# Altium schematic sheet power.SchDoc
size A3
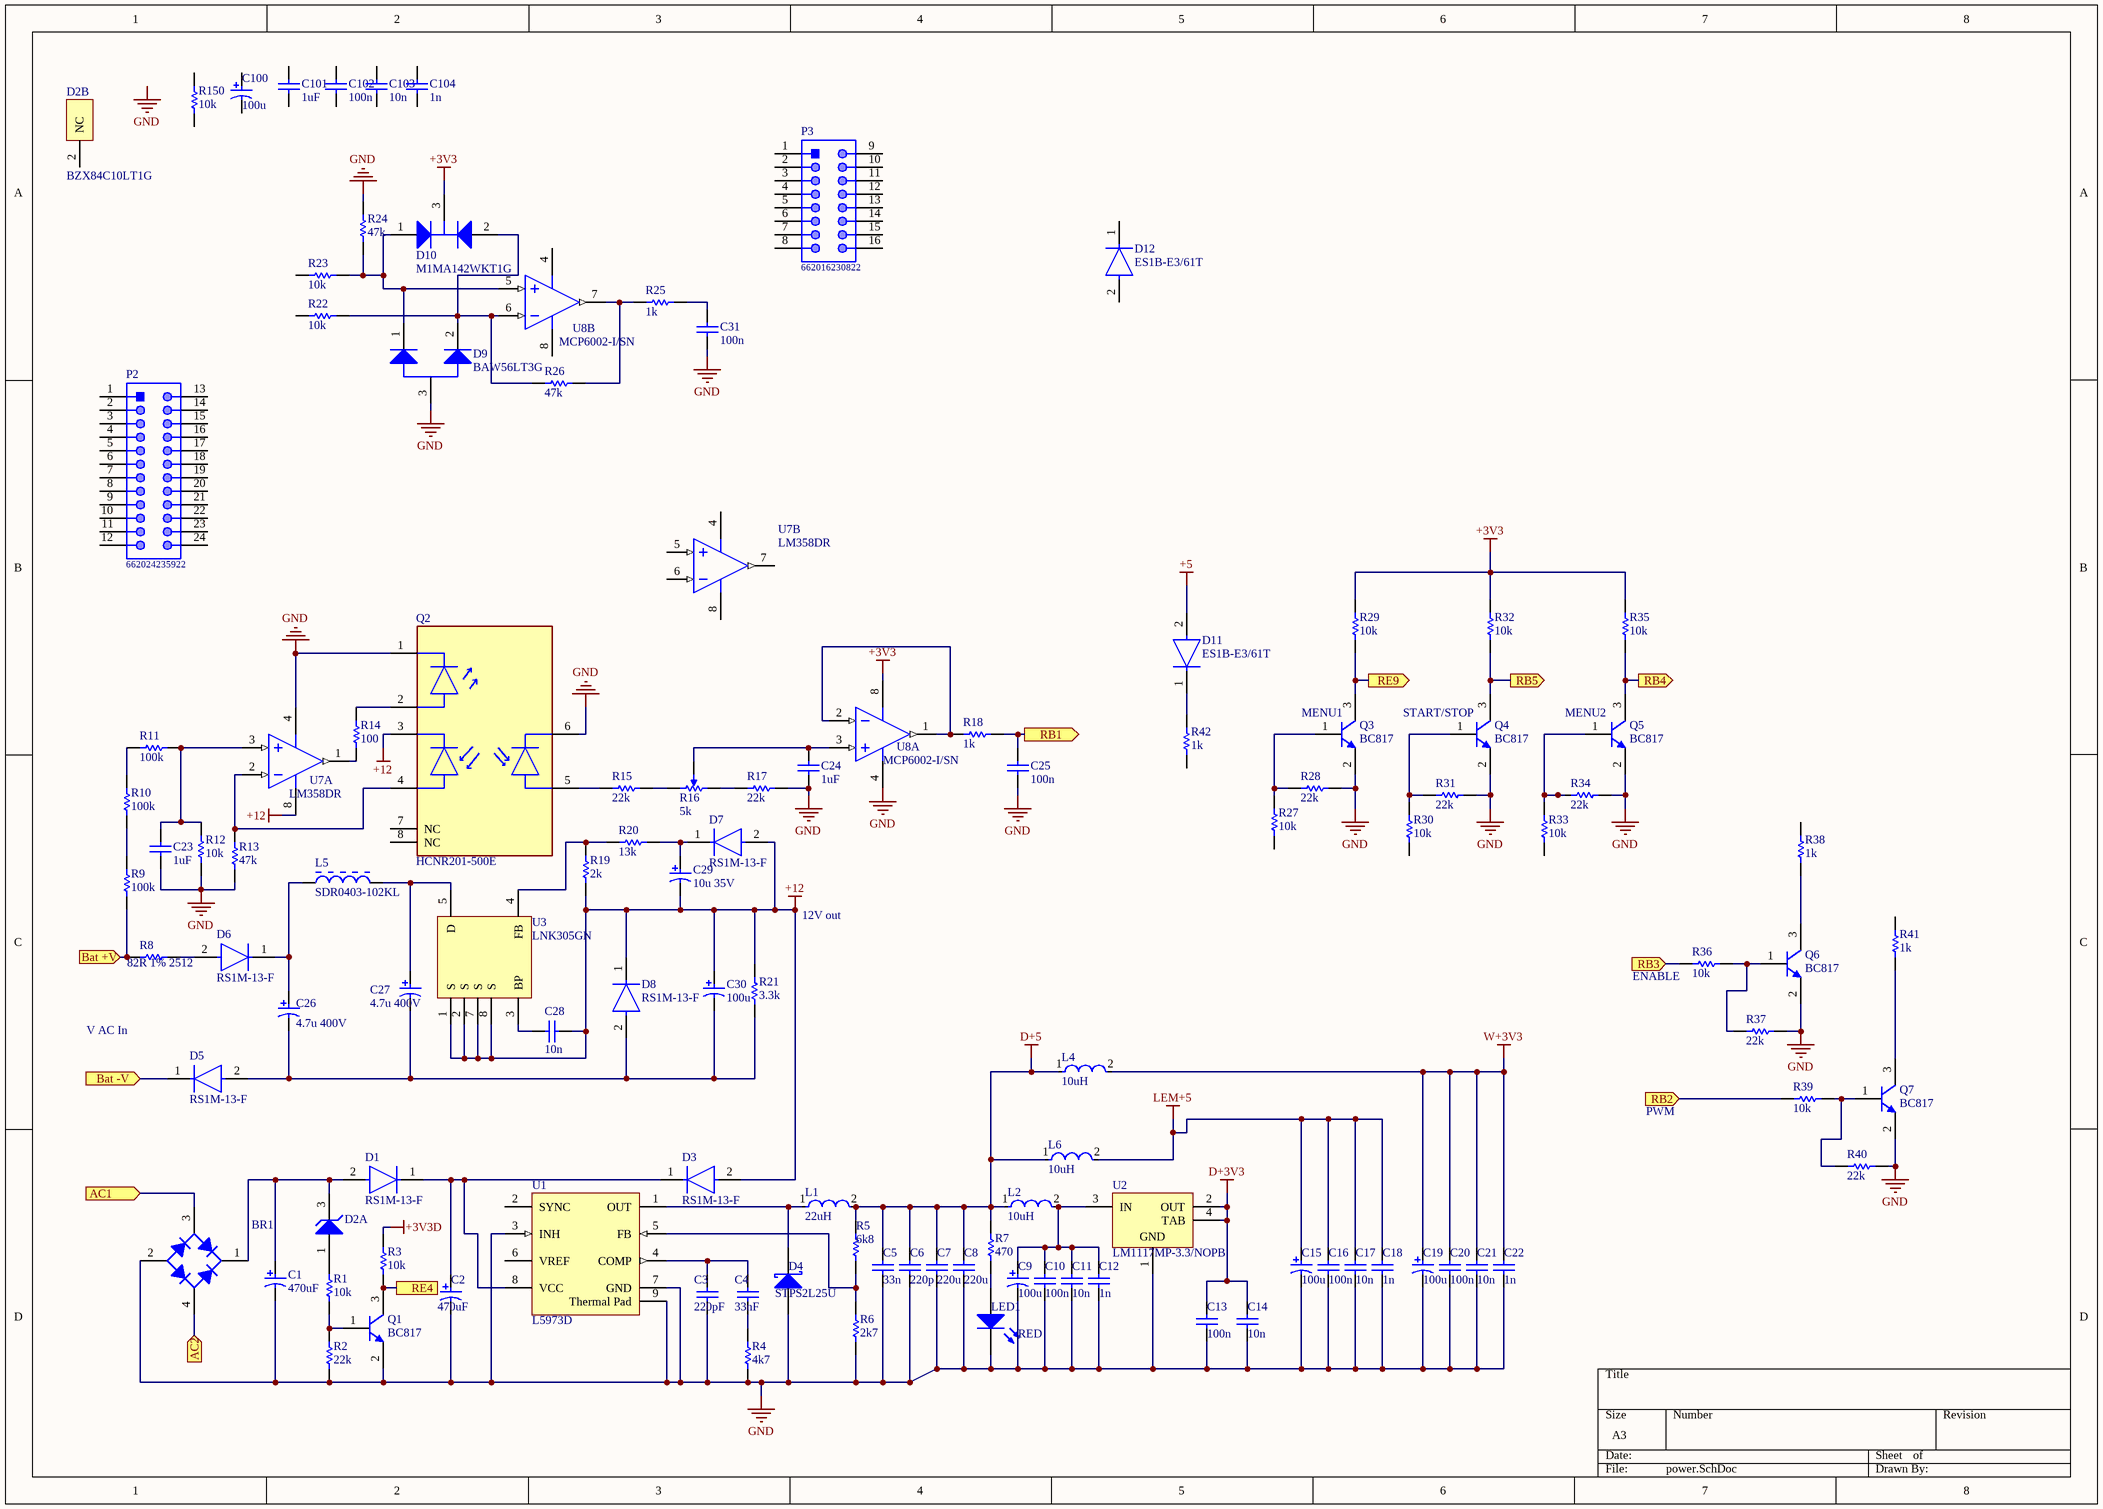
[diagram p0: power.SchDoc]

## Parts
BR1  DF10S  [FAIR-SDIP-4_V]  (value not drawn)
C1  470uF  [PNSC-EEV-FK1J471M_L]
C2  470uF  [PNSC-EEV-FK1J471M_L]
C3  220pF  [CAPC2013X140X50ML20T25]
C4  33nF  [CAPC0805(2012)100_L]
C5  33n  [CAPC0805(2012)100_L]
C6  220p  [CAPC2013X140X50ML20T25]
C7  220u  [CAPC2013X120X55NL10T10]
C8  220u  [CAPC2013X120X55NL10T10]
C9  100u  [KEMT-T495-D_L]
C10  100n  [CAPC2013X88X50NL20T25]
C11  10n  [CAPC2013X140X50LL20T25]
C12  1n  [CAPC0805(2012)145_L]
C13  100n  [CAPC2013X88X50NL20T25]
C14  10n  [CAPC2013X140X50LL20T25]
C15  100u  [KEMT-T495-D_L]
C16  100n  [CAPC2013X88X50NL20T25]
C17  10n  [CAPC2013X140X50LL20T25]
C18  1n  [CAPC0805(2012)145_L]
C19  100u  [KEMT-T495-D_L]
C20  100n  [CAPC2013X88X50NL20T25]
C21  10n  [CAPC2013X140X50LL20T25]
C22  1n  [CAPC0805(2012)145_L]
C23  1uF  [CAPC0805(2012)145_L]
C24  1uF  [CAPC0805(2012)145_L]
C25  100n  [CAPC2013X88X50NL20T25]
C26  4.7u 400V  [NIC-ULR-8x10-2_V]
C27  4.7u 400V  [NIC-ULR-8x10-2_V]
C28  10n  [CAPC2013X140X50LL20T25]
C29  10u 35V  [KEMT-T491-D_L]
C30  100u  [KEMT-T491-D_L]
C31  100n  [CAPC2013X88X50NL20T25]
C100  100u  [KEMT-T495-D_L]
C101  1uF  [CAPC0805(2012)145_L]
C102  100n  [CAPC2013X88X50NL20T25]
C103  10n  [CAPC2013X140X50LL20T25]
C104  1n  [CAPC0805(2012)145_L]
D1  RS1M-13-F  [FP-SMA-MFG]
D2  BZX84C10LT1G  [ONSC-SOT-23-3-318-08_V]  (value not drawn)  (parts A,B of 2)
D3  RS1M-13-F  [FP-SMA-MFG]
D4  STPS2L25U  [STM-SMB_P_V]
D5  RS1M-13-F  [FP-SMA-MFG]
D6  RS1M-13-F  [FP-SMA-MFG]
D7  RS1M-13-F  [FP-SMA-MFG]
D8  RS1M-13-F  [FP-SMA-MFG]
D9  BAW56LT3G  [ONSC-SOT-23-3-318-08_V]
D10  M1MA142WKT1G  [ONSC-SOT-323-3-419-04_V]
D11  ES1B-E3/61T  [FP-95400-MFG]
D12  ES1B-E3/61T  [FP-95400-MFG]
L1  22uH  [FP-IHLP-2525CZ-FP_2_413x3-MFG]
L2  10uH  [FP-IHLP-2020BZ-FP_1_905x2-MFG]
L4  10uH  [FP-IHLP-2020BZ-FP_1_905x2-MFG]
L5  SDR0403-102KL  [BOUR-SDR0403-2_V]
L6  10uH  [FP-IHLP-2020BZ-FP_1_905x2-MFG]
LED1  RED  [0603_A]
P2  662024235922  [662024235922]
P3  662016230822  [662016230822]
Q1  BC817  [ONSC-SOT-23-3-318-08_V]
Q2  HCNR201-500E  [FP-HCNR201-500E-MFG]
Q3  BC817  [ONSC-SOT-23-3-318-08_V]
Q4  BC817  [ONSC-SOT-23-3-318-08_V]
Q5  BC817  [ONSC-SOT-23-3-318-08_V]
Q6  BC817  [ONSC-SOT-23-3-318-08_V]
Q7  BC817  [ONSC-SOT-23-3-318-08_V]
R1  10k  [RESC2013X70X40LL20T20]
R2  22k  [RESC2013X70X40NL20T20]
R3  10k  [RESC2013X70X40LL20T20]
R4  4k7  [RESC2013X70X40LL20T20]
R5  6k8  [RESC2013X70X40LL20T20]
R6  2k7  [RESC2013X70X40NL20T20]
R7  470  [RESC2013X70X40ML20T20]
R8  82R 1% 2512  [RESC2512(6432)_N]
R9  100k  [RESC2013X70X40ML20T20]
R10  100k  [RESC2013X70X40ML20T20]
R11  100k  [RESC2013X70X40ML20T20]
R12  10k  [RESC2013X70X40ML20T20]
R13  47k  [RESC2013X70X40ML20T20]
R14  100  [RESC2013X70X40LL20T20]
R15  22k  [RESC2013X70X40NL20T20]
R16  5k  [BOUR-3314J-1_V]
R17  22k  [RESC2013X70X40NL20T20]
R18  1k  [RESC2013X70X40ML20T20]
R19  2k  [RESC2013X70X40NL20T20]
R20  13k  [RESC2013X70X40NL20T20]
R21  3.3k  [RESC2013X70X40LL20T20]
R22  10k  [RESC2013X70X40ML20T20]
R23  10k  [RESC2013X70X40ML20T20]
R24  47k  [RESC2013X70X40ML20T20]
R25  1k  [RESC2013X70X40ML20T20]
R26  47k  [RESC2013X70X40ML20T20]
R27  10k  [RESC2013X70X40ML20T20]
R28  22k  [RESC2013X70X40NL20T20]
R29  10k  [RESC2013X70X40ML20T20]
R30  10k  [RESC2013X70X40ML20T20]
R31  22k  [RESC2013X70X40NL20T20]
R32  10k  [RESC2013X70X40ML20T20]
R33  10k  [RESC2013X70X40ML20T20]
R34  22k  [RESC2013X70X40NL20T20]
R35  10k  [RESC2013X70X40ML20T20]
R36  10k  [RESC2013X70X40ML20T20]
R37  22k  [RESC2013X70X40NL20T20]
R38  1k  [RESC2013X70X40ML20T20]
R39  10k  [RESC2013X70X40ML20T20]
R40  22k  [RESC2013X70X40NL20T20]
R41  1k  [RESC2013X70X40ML20T20]
R42  1k  [RESC2013X70X40ML20T20]
R150  10k  [RESC2013X70X40ML20T20]
U1  L5973D  [HSO-8_L]
U2  LM1117MP-3.3/NOPB  [DCY0004A_N]
U3  LNK305GN  [PI-SMD-8B-7_V]
U7  LM358DR  [D0008A_L]  (parts A,B of 2)
U8  MCP6002-I/SN  [SOIC-SN8_M]  (parts A,B of 2)

## Ports
AC1 (in), AC2 (in), Bat +V (in), Bat -V (in), RB1 (out), RB2 (in), RB3 (in), RB4 (out), RB5 (out), RE4, RE9 (out)

## Nets
+3V3: D10.3(K) R29.1 R32.1 R35.1 U8.8(VDD)
+3V3D: R3.2
+5: D11.2(A)
+12: C28.1 C29.2 C30.1 D3.2(A) D7.2(A) D8.1(C) Q2.3(PD1_CATHODE) R19.1 R21.2 U3.1(S) U3.2(S) U3.7(S) U3.8(S) U7.8(VCC)
D+3V3: C13.2 C14.2 U2.2(OUT) U2.4(TAB)
D+5: C5.2 C6.2 C7.2 C8.2 L1.2 L2.1 L4.1 L6.1 R5.2 R7.2
GND: BR1.2(A) C1.2 C2.2 C3.1 C5.1 C6.1 C7.1 C8.1 C9.2 C10.1 C11.1 C12.1 C13.1 C14.1 C15.2 C16.1 C17.1 C18.1 C19.2 C20.1 C21.1 C22.1 C23.1 C24.1 C25.1 C31.1 D4.1(A) D9.3(A) LED1.1(K) Q1.2(E) Q2.1(LED_CATHODE) Q2.6(PD2_CATHODE) Q3.2(E) Q4.2(E) Q5.2(E) Q6.2(E) Q7.2(E) R2.1 R4.1 R6.1 R12.1 R13.2 R17.2 R24.2 R28.2 R31.2 R34.2 R37.2 R40.2 U1.3(INH) U1.7(GND) U1.9(Thermal_Pad) U2.1(GND) U7.4(GND) U8.4(VSS)
LEM+5: C15.1 C16.2 C17.2 C18.2 L6.2
W+3V3: C19.1 C20.2 C21.2 C22.2 L4.2
AC1: BR1.3(C) ; port AC1
AC2: BR1.4(C) ; port AC2
Bat +V: R8.1 R9.1 ; port Bat +V
Bat -V: D5.1(C) ; port Bat -V
RB1: C25.2 R18.2 ; port RB1
RB2: R39.1 ; port RB2
RB3: R36.1 ; port RB3
RB4: Q5.3(C) R35.2 ; port RB4
RB5: Q4.3(C) R32.2 ; port RB5
RE4: Q1.3(C) R3.1 ; port RE4
RE9: Q3.3(C) R29.2 ; port RE9
NetBR1_1: BR1.1(K) C1.1 D1.2(A) D2.3(K)
NetC2_1: C2.1 D1.1(C) D3.1(C) U1.8(VCC)
NetC3_2: C3.2 C4.2 U1.4(COMP)
NetC4_1: C4.1 R4.2
NetC9_1: C9.1 C10.2 C11.2 C12.2 L2.2 U2.3(IN)
NetC23_2: C23.2 R11.1 R12.2 U7.3(1IN+)
NetC24_2: C24.2 R16.2 U8.3(VINA+)
NetC26_1: C26.1 D6.1(C) L5.1
NetC26_2: C26.2 C27.2 C30.2 D5.2(A) D8.2(A) R21.1
NetC27_1: C27.1 L5.2 U3.5(D)
NetC28_2: C28.2 U3.3(BP)
NetC29_1: C29.1 D7.1(C) R20.2
NetC31_2: C31.2 R25.1
NetD2_1: D2.1(A) R1.2
NetD4_2: D4.2(K) L1.1 U1.1(OUT)
NetD6_2: D6.2(A) R8.2
NetD9_1: D9.1(K1) D10.1(A1) R23.1 R24.1 U8.5(VINB+)
NetD9_2: D9.2(K2) D10.2(A2) R22.1 R26.1 U8.6(VINB-)
NetD11_1: D11.1(C) R42.2
NetLED1_2: LED1.2(A) R7.1
NetQ1_1: Q1.1(B) R1.1 R2.2
NetQ2_2: Q2.2(LED_ANODE) R14.2
NetQ2_4: Q2.4(PD1_ANODE) R13.1 U7.2(1IN-)
NetQ2_5: Q2.5(PD2_ANODE) R15.2
NetQ3_1: Q3.1(B) R27.1 R28.1
NetQ4_1: Q4.1(B) R30.1 R31.1
NetQ5_1: Q5.1(B) R33.1 R34.1
NetQ6_1: Q6.1(B) R36.2 R37.1
NetQ6_3: Q6.3(C) R38.1
NetQ7_1: Q7.1(B) R39.2 R40.1
NetQ7_3: Q7.3(C) R41.1
NetR5_1: R5.1 R6.2 U1.5(FB)
NetR9_2: R9.2 R10.1
NetR10_2: R10.2 R11.2
NetR14_1: R14.1 U7.1(1OUT)
NetR15_1: R15.1 R16.3
NetR16_1: R16.1 R17.1
NetR18_1: R18.1 U8.1(VOUTA) U8.2(VINA-)
NetR19_2: R19.2 R20.1 U3.4(FB)
NetR25_2: R25.2 R26.2 U8.7(VOUTB)

Not connected (* = marked no-connect by the designer): C100 1 2; C101 1 2; C102 1 2; C103 1 2; C104 1 2; D2 2(NC); D12 1(C) 2(A); P2 1 2 3 4 5 6 7 8 9 10 11 12 13 14 15 16 17 18 19 20 21 22 23 24; P3 1 2 3 4 5 6 7 8 9 10 11 12 13 14 15 16; Q2 7(NC) 8(NC); R22 2; R23 2; R27 2; R30 2; R33 2; R38 2; R41 2; R42 1; R150 1 2; U1 2(SYNC) 6(VREF); U7 5(2IN+) 6(2IN-) 7(2OUT)

## Notes on the sheet
- (near Q3) MENU1
- (near Q4) START/STOP
- (near Q5) MENU2
- 12V out
- (near R36) ENABLE
- V AC In
- PWM
- Labels drawn without touching a wire or pin: GND

## Library data of the parts
BR1 = CMP-2000-06153-1: Bridge Rectifier, 1.5 A, 1000 V, 4-Pin SDIP, RoHS, Tape and Reel; Manufacturer: FairchildSemiconductor; Configuration: Single; Peak Average Forward Current: 1.5@Ta=40CA; Peak Reverse Repetitive Voltage: 1000V; Peak Reverse Current: 5uA; Bridge Type: SinglePhase; Peak Forward Voltage: 1.1@1AV; Datasheet Version: Rev. 1.5, 05/2015; Package: 4SDIPSMD; Operating Temperature: -55to150°C; Package Reference: SDIP 4L; Datasheet URL: http://www.farnell.com/datasheets/1941063.pdf; Packaging: Tape&Reel; Manufacturer URL: https://www.fairchildsemi.com/; Mounting Technology: SurfaceMount; Category: BridgeRectifier; Package Description: 4-Pin Surface Mount Device, Body 8.28 x 6.35 mm, Pitch 5.1 mm; Mounting: SurfaceMount
C1 C2 = CMP-1665-00018-3: Aluminum Electrolytic Capacitor (SMD Type), 470 uF, 63 V, -55 to 105 degC, 2-Pin CAPAE, RoHS, Tape and Reel; Manufacturer: Panasonic; Voltage Rating: 63 V; Mounting Technology: Surface Mount; Length: 17 mm; PackageDescription: 2-Pin Electrolytic Aluminum Capacitor, Body 17 x 17 mm; Package Quantity: 125; ComponentLink1URL: http://www.panasonic.com/; RoHSCompliant: true; REACH SVHC: Unknown; Pins: 2; DatasheetVersion: 03/2016; PackageReference: EEV-FK1J471M; Min Operating Temperature: -55 degC; ComponentLink2URL: https://industrial.panasonic.com/cdbs/www-data/pdf/RDE0000/ABA0000C1181.pdf; Height: 16.5 mm; ComponentLink2Description: Datasheet; ComponentLink1Description: Manufacturer URL; Mount: Surface Mount; Packaging: Tape and Reel; Max Operating Temperature: 105 degC
C3 C6 = CMP-2007-04624-1: Manufacturer: AVX Interconnect / Elco; Part Number: 08055A221JAT2A
C4 C5 = CMP-1036-04167-1: CAP 33nF 50V ±5% 0805 (2012 Metric) Thickness 1mm SMD; Case-EIA: 0805; Tolerance: Â±5%; Case-Metric: 2012; Technology: SMT; Max Thickness: 1 mm; Value: 33nF; Rated Voltage: 50 V
C7 C8 = CMP-2007-03638-1: Part Number: T488R227M004AAE2K0; Manufacturer: Kemet
C9 C15 C19 C100 = CMP-2000-07207-1: Capacitor, Tantalum, 100 uF, +/- 10%, 16 V, -55 to 125 degC, 2-Pin SMD, RoHS, Tape and Reel; Manufacturer: Kemet; Case Style: Molded; Product Diameter (mm): NotRequiredmm; Wire Form: NotRequired; Product Length (mm): 7.3mm; DF: 8%; Capacitance: 100000000pF; DCL: 16uA; Polarity: Polar; Voltage: 16VDC; ESR: 0.125ohm; Product Height (mm): 2.8mm; Product Depth (mm): 4.3mm; Rad Hardened: No; Failure Rate: NotRequired; Construction: SMTChip; Tolerance (+ or -): 10%; Seated Plane Height: NotRequiredmm; Packaging: TapeandReel; Datasheet URL: http://capacitoredge.kemet.com/capedge2/DataSheet/Datasheet-T495D107K016ATE125.pdf?pn=T495D107K016ATE125; Length W/Weld (max): NotRequiredmm; Package Description: 2-Pin Surface Mount Device, Body 7.3 x 4.3 mm; Manufacturer URL: http://www.kemet.com/; Case Code: D; Lead Spacing (nom): NotRequiredmm; Operating Temp Range: -55Cto125C; Seal: NotRequired; Package / Case: 7343-31; Insulation: NotRequired; Datasheet Version: 09/2016; Package Reference: T495-D; Mounting Technology: SurfaceMount; Length W/Weld: NotRequiredmm; Mounting Style: SurfaceMount
C10 C13 C16 C20 C25 C31 C102 = CMP-2007-00279-1: Part Number: C0805C104K5RACTU; Manufacturer: Kemet
C11 C14 C17 C21 C28 C103 = CMP-2007-04788-1: Part Number: 08055F103KAT2A; Manufacturer: AVX Interconnect / Elco
C12 C18 C22 C104 = CMP-1036-02979-1: CAP 1nF 50V ±10% 0805 (2012 Metric) Thickness 1.45mm SMD; Tolerance: Â±10%; Case-EIA: 0805; Case-Metric: 2012; Value: 1nF; Rated Voltage: 50 V; Technology: SMT; Max Thickness: 1.45 mm
C23 C24 C101 = CMP-1036-04761-1: CAP 1uF 50V ±10% 0805 (2012 Metric) Thickness 1.45mm SMD; Tolerance: Â±10%; Case-EIA: 0805; Case-Metric: 2012; Technology: SMT; Value: 1uF; Max Thickness: 1.45 mm; Rated Voltage: 50 V
C26 C27 = CMP-0952-00001-1: Aluminum Electrolytic Capacitor, High Voltage, 4.7 uF +/- 20%, 400 V, -40 to 105 degC, 2-Pin 8.3 x 8.3 x 11 mm SMD, RoHS, Reel; PartNumber: ULR2G4R7MNL1GS; Manufacturer: Nichicon; Polarity Type: Polar; Rated Capacitance: 4.7 uF; Packing: Tape; Capacitance Tolerance: +/- 20%; PackageDescription: 2-Pin SMD,Body 8.3 x 8.3 mm, Height 11 mm; ComponentLink1URL: http://www.nichicon.co.jp/; ComponentLink2Description: Datasheet; Rated Voltage: 400 V; Mounting Technology: Surface Mount; ComponentLink2URL: http://www.nichicon.co.jp/english/products/pdfs/e-lr.pdf; PackageReference: ULR-8x10-2; RoHS: TRUE; ComponentLink1Description: Manufacturer URL; Category Temperature Range: -40 to 105 degC
C29 = CMP-2000-07580-1: Tantalum Capacitor, 10 uF, +/- 10%, 35 V, -55 to 125 degC, 2-Pin SMD, RoHS, Tape and Reel; Manufacturer: Kemet; Capacitance: 10uF; Leakage Current: 3.5uA; Dissipation Factor: 6%; Case\/Package: 2917; Polarity: Polar; ESR (Equivalent Series Resistance): 1Ohm; Life (Hours): 2000Hour; Tolerance: 20%; Max Operating Temperature: 125degC; Length: 7.3mm; Depth: 4.3mm; Termination: SMD/SMT; Case Code (Metric): 7343; Number of Pins: 2; Package Reference: T491-D; Width: 4.3mm; Voltage Rating: 35V; RoHSCompliant: True; Lead Free: LeadFree; Radiation Hardening: No; Height: 2.8mm; Voltage Rating (DC): 35V; REACH SVHC: NoSVHC; Datasheet URL: http://www.kemet.com/Lists/ProductCatalog/Attachments/254/KEM_T2005_T491.pdf; Datasheet Version: 07/2017; Manufacturer URL: http://www.kemet.com/; Mounting Technology: SurfaceMount; Min Operating Temperature: -55degC; Case Code (Imperial): 2917; Package Quantity: 1; Packaging: TapeandReel; Package Description: 2-Pin Surface Mount Device, Body 7.3 x 4.3 mm; Height - Seated (Max): 0.122inch; Voltage: 35V; Dielectric Material: Tantalum; Mount: PCB
C30 = CMP-2000-07541-1: Tantalum Surface Mount Capacitor, 100 uF, +/- 10%, 16 V, -55 to 125 degC, 2917 (7343 Metric), RoHS, Tape and Reel; Manufacturer: Kemet; ESR (Equivalent Series Resistance): 700mOhm; Dissipation Factor: 8%; Voltage Rating (DC): 16V; Case\/Package: Molded; Polarity: Polar; Capacitance: 100uF; Life (Hours): 2000Hour; Leakage Current: 16uA; Ripple Current: 463mA; RoHSCompliant: true; Datasheet Version: 07/2017; Case Code (Imperial): 2917; Width: 4.3mm; Height: 2.8mm; Min Operating Temperature: -55degC; Length: 7.3mm; Package Reference: T491-D; Dielectric Material: Tantalum; Packaging: TapeandReel; Max Operating Temperature: 125degC; Package Description: 2-Pin Surface Mount Device, Body 7.3 x 4.3 mm; Package Quantity: 1; Lead Free: LeadFree; Case Code (Metric): 7343; Voltage: 16V; Voltage Rating: 16V; Tolerance: 10%; Weight: 0.023634oz; Termination: SMD/SMT; Lead Pitch: 3.6mm; Manufacturer URL: http://www.kemet.com/; Datasheet URL: http://www.kemet.com/Lists/ProductCatalog/Attachments/254/KEM_T2005_T491.pdf; Radiation Hardening: No; Mount: PCB; Height - Seated (Max): 0.122inch; Mounting Technology: SurfaceMount; Depth: 4.3mm; REACH SVHC: NoSVHC
D1 D3 D5-D8 = CMP-12791-000020-1: DIODE GEN PURP 1KV 1A SMA; Manufacturer: Diodes Inc.; Capacitance: 15pF; Max Repetitive Reverse Voltage: 1000V; Value: 15pF; Standoff Height: 0.05mm; Peak Reverse Current: 5uA; Max Junction Temp: +150°C; Max Surge Forward Current: 30A; Device Class L2: Diodes; Device Class L3: Rectifier Diodes; ComponentLink2Description: Datasheet; Temperature Range Low: -65°C; Footprint Url: https://www.diodes.com/assets/Package-Files/SMA.pdf; Device Class L1: Discrete Semiconductors; Manufacturer Part Number: RS1M-13-F; Digikey Description: DIODE GEN PURP 1KV 1A SMA; ComponentLink2URL: https://www.diodes.com/assets/Datasheets/ds15002.pdf; Forward Current: 1A; Height: 2.4mm; Reverse Voltage: 1000V; Lead Free: Yes; Temperature: -65°C to +150°C; Package: SMA; Octopart: https://octopart.com/rs1m-13-f-diodes+inc.-333072; Mouser Description: Rectifiers 1.0A 1000V; RoHS: TRUE; Temperature Range High: +150°C; Category: Diode; Automotive: No
D2 = CMP-1060-00877-1: Zener Voltage Regulator, 225 mW, 3-Pin SOT-23, Pb-Free, Tape and Reel; Manufacturer: On Semiconductor; ComponentLink1Description: Manufacturer URL; PartNumber: BZX84C10LT1G; ComponentLink1URL: http://www.onsemi.com/; DatasheetVersion: Rev. 17; ComponentLink2Description: Datasheet; ComponentLink3Description: Package Specification; PackageReference: SOT-23-3-318-08; ComponentLink3URL: http://www.onsemi.cn/pub_link/Collateral/318-08.PDF; Packing: Tape and Reel; RoHS: Pb-Free; PackageDescription: 3-Pin Small Outline Transistor, Body 2.92 x 1.3 mm, Pitch 0.95 mm; ComponentLink2URL: http://www.onsemi.com/pub_link/Collateral/BZX84C2V4LT1-D.PDF; Mounting Technology: Surface Mount; PackageVersion: Rev. AP, 11/2009
D4 = CMP-2000-07176-1: Low Drop Power Schottky Rectifier, 2 A, 25 V, 2-Pin SMD (SMB), RoHS, Tape and Reel; Manufacturer: STMicroelectronics; Speed: FastRecovery=200mA(Io); Voltage - Forward (Vf) (Max) @ If: 450mV@2A; Other Related Documents: STPS2L25ViewAllSpecifications; Online Catalog: SchottkyDiode; Current - Average Rectified (Io): 2A; Current - Reverse Leakage @ Vr: 90µA@25V; Voltage - DC Reverse (Vr) (Max): 25V; Other Names: 497-5573-6; Manufacturer URL: http://www.st.com/; Series: -; Capacitance @ Vr, F: -; Reverse Recovery Time (trr): -; Category: DiscreteSemiconductorProducts; Diode Type: Schottky; Datasheet URL: http://www.st.com/content/ccc/resource/technical/document/datasheet/f9/71/8b/51/48/04/4b/9b/CD00001325.pdf/files/CD00001325.pdf/jcr:content/translations/en.CD00001325.pdf; Package Description: 2-Pin Surface Mount Device, Body 4.325 x 3.625 mm; Mounting Technology: SurfaceMount; Operating Temperature - Junction: 150°C(Max); Datasheet Version: 02/2007; Package / Case: DO-214AA,SMB; Mounting Type: SurfaceMount; Family: Diodes,Rectifiers-Single; Package URL: http://www.st.com/st-web-ui/static/active/en/resource/technical/document/datasheet/CD00279657.pdf; Package Reference: SMB_P; Standard Package: 1; Packaging: Digi-Reel®; Supplier Device Package: SMB
D9 = CMP-1054-00110-1: Dual Switching Diodes, Common Anode, 3-Pin SOT-23, Pb-Free, Tape and Reel; Manufacturer: On Semiconductor; trr Max (ns): 6; IF Max (A): 0.2; ComponentLink1Description: Manufacturer URL; RoHS: TRUE; ComponentLink3Description: Package Specification; DatasheetVersion: Rev. 8; Packing: Tape and Reel; Configuration: Common Anode; PartNumber: BAW56LT3G; PackageReference: SOT-23-3-318-08; PackageVersion: Rev. AP, 11/2009; ComponentLink1URL: http://www.onsemi.com/; ComponentLink3URL: http://www.onsemi.cn/pub_link/Collateral/318-08.PDF; ComponentLink2Description: Datasheet; ComponentLink2URL: http://www.onsemi.cn/pub_link/Collateral/BAW56LT1-D.PDF; Mounting Technology: Surface Mount; PackageDescription: 3-Pin Small Outline Transistor, Body 2.92 x 1.3 mm, Pitch 0.95 mm
D10 = CMP-1054-00181-1: Common Cathode Silicon Dual Switching Diodes, 3-Pin SOT-323, Pb-Free, Tape and Reel; Manufacturer: On Semiconductor; trr Max (ns): 3; PackageReference: SOT-323-3-419-04; PartNumber: M1MA142WKT1G; ComponentLink3URL: http://www.onsemi.com/pub_link/Collateral/419-04.PDF; ComponentLink1URL: http://www.onsemi.com/; ComponentLink2Description: Datasheet; Configuration: Common Cathode; RoHS: TRUE; Mounting Technology: Surface Mount; DatasheetVersion: Rev. 9; Packing: Tape and Reel; PackageDescription: 3-Pin Small Outline Transistor, Body 2 x 1.25 mm, Pitch 0.65 mm; ComponentLink2URL: http://www.onsemi.cn/pub_link/Collateral/M1MA141WKT1-D.PDF; ComponentLink3Description: Package Specification; PackageVersion: Rev. N, 11/2008; ComponentLink1Description: Manufacturer URL
D11 D12 = CMP-02540-000045-1: DIODE GEN PURP 100V 1A DO214AC; Manufacturer: Vishay; Max Junction Temp: +150°C; Standoff Height: 0mm; Capacitance: 10pF; Peak Reverse Current: 5uA; Max Surge Forward Current: 30A; Value: 10pF; Reverse Voltage: 100V; Manufacturer Part Number: ES1B-E3/61T; RoHS: TRUE; Mouser Description: Diode Ultra Fast Recovery Rectifier 100V 1A 2-Pin DO-214AC T/R; Temperature Range Low: -55°C; Footprint Url: https://www.vishay.com/docs/95400/sma.pdf; ComponentLink2Description: Datasheet; Package: 95400; Max Repetitive Reverse Voltage: 100V; Octopart: https://octopart.com/es1b-e3%2F61t-vishay-39550258; Lead Free: Yes; Temperature: -55°C to +150°C; Height: 2.29mm; Device Class L1: Discrete Semiconductors; Category: Diode; Automotive: No; Device Class L2: Diodes; Forward Current: 1A; Temperature Range High: +150°C; ComponentLink2URL: http://www.vishay.com/docs/88586/es1.pdf; Digikey Description: DIODE GEN PURP 100V 1A DO214AC; Device Class L3: Rectifier Diodes
L1 = CMP-02424-000275-1: Commercial Inductors, Low DCR Series 22uH 2.9A 135mΩ 20%; Self Resonant Frequency: 1MHz; Shielding: Shielded; Core Material: Ferrite; DC Resistance (DCR): 135mR; Test Frequency: 100kHz; Saturation Current: 2.5A; Case/Package: 2525; Inductance Tolerance: 20%; Max DC Current: 2.9A; Inductance: 22uH; Termination: SMD/SMT; Case Code (Imperial): 2525; Mount: Surface Mount; Military Standard: Not; Min Operating Temperature: -55°C; RMS Current (Irms): 2.9A; Package Quantity: 2000; Max Operating Temperature: 125°C; Length: 7.24mm; Depth: 6.72mm; Packaging: Tape and Reel; Height: 3mm; Width: 0.255inch; Lead Free: Lead Free; Tolerance: 20%; Contact Plating: Tin; Current Rating: 2.9A; Number of Pins: 2; Case Code (Metric): 6363; Radiation Hardening: No; Height - Seated (Max): 0.118inch
L2 L4 L6 = CMP-02424-000159-1: Fixed Inductors Commercial High Saturation Series 10uH 2.3A 199mΩ 20%; Test Frequency: 100kHz; Saturation Current: 4A; Self Resonant Frequency: 20MHz; DC Resistance (DCR): 199mR; Core Material: Ferrite; Shielding: Shielded; RMS Current (Irms): 2.3A; Length: 5.49mm; Height - Seated (Max): 0.079inch; Tolerance: 20%; Number of Pins: 2020; Height: 2mm; Packaging: Tape and Reel; Case/Package: 2020; Lead Free: Lead Free; Width: 0.204inch; Inductance Tolerance: 20%; Inductance: 10uH; Depth: 5.43mm; Termination: SMD/SMT; Radiation Hardening: No; Min Operating Temperature: -55°C; Max Operating Temperature: 125°C; Mount: Surface Mount; Current Rating: 2.3A; Package Quantity: 2000; Military Standard: Not; Max DC Current: 2.3A
L5 = CMP-0904-00027-1: SDR0403 Series Power Inductor, 1000 uF +/- 10 %, 14 Ohm, -40 to 125 degC, 2-Pin SMD, RoHS, Tape and Reel; Manufacturer: Bourns; Tolerance (%): +/- 10; Test Frequency (MHz): 0.252; SRF (MHz): 2 Min.; Inductance (uH): 1000; I rms (A): 0.09 Max.; RDC (Ohm): 14 Max.; Q: 38; I sat (A): 0.13 Typ.; PackageReference: SDR0403-2; ComponentLink1URL: http://www.bourns.com/; PackageDescription: 3-Pin SMD, Dia 4.5 mm, Height 3.5 mm; Mounting Technology: Surface Mount; Packing: Tape and Reel; DatasheetVersion: Feb-12; RoHS: TRUE; PartNumber: SDR0403-102KL; ComponentLink1Description: Manufacturer URL; Temperature Range: -40 to 125 degC; ComponentLink2URL: http://www.bourns.com/data/global/pdfs/sdr0403.pdf; ComponentLink2Description: Datasheet
LED1 = CMP-1426-00001-1: SMD mono-color Chip LED, WL-SMCW, Red; Manufacturer: Wuerth Elektronik; PartNumber: 150060RS75000; Color: Red; PackageReference: 0603_A; ComponentLink2URL: http://katalog.we-online.com/led/datasheet/150060RS75000.pdf; ComponentLink1URL: http://www.we-online.com; ComponentLink1Description: Manufacturer URL; ComponentLink2Description: Datasheet
P2 = CMP-1502-00331-1: SMT Male Header WR-MPC3, with THT Retention Clips, Vertical, Dual Row, pitch 3 mm, 24 pins; Manufacturer: Wurth Elektronik; Pin Number: 24; Pitch: 3mm; Contact Resistance: 10mOhm; Working Voltage: 250VAC; Package Reference: 662024235922; Operating Temperature: -40to105degC; Publisher: WurthElektronik; Packaging: Tube; Part Number: 662024235922; Manufacturer URL: http://www.we-online.de; Datasheet URL: https://katalog.we-online.de/em/datasheet/6620xx235922.pdf; Orientation: Vertical; Mounting Technology: SMT; Gender: Male
P3 = CMP-1502-00403-1: SMT Male Header WR-MPC3, with THT Rention Clips, Right Angled, Dual Row, pitch 3 mm, 16 pins; Manufacturer: Wurth Elektronik; Pitch: 3mm; Pin Number: 16; Working Voltage: 250VAC; Contact Resistance: 10mOhm; Publisher: WurthElektronik; Mounting Technology: SMT; Package Reference: 662016230822; Datasheet URL: https://katalog.we-online.de/em/datasheet/6620xx230822.pdf; Part Number: 662016230822; Manufacturer URL: http://www.we-online.de; Operating Temperature: -40to105degC; Packaging: Tube; Orientation: RightAngled; Gender: Male
Q1 Q3-Q7 = CMP-1048-00736-1: General Purpose Transistor, NPN Silicon, 3-Pin SOT-23, Pb-Free, Tape and Reel; PartNumber: BC817-16LT1G; Manufacturer: On Semiconductor; IC Continuous (A): 0.5; fT Min (MHz): 100; Mounting Technology: Surface Mount; PackageVersion: Rev. AP, 11/2009; ComponentLink3Description: Package Specification; PackageReference: SOT-23-3-318-08; Packing: Tape and Reel; ComponentLink1URL: http://www.onsemi.com/; Polarity: NPN; RoHS: TRUE; ComponentLink2URL: http://www.onsemi.com/pub_link/Collateral/BC817-16LT1-D.PDF; ComponentLink3URL: http://www.onsemi.cn/pub_link/Collateral/318-08.PDF; ComponentLink2Description: Datasheet; PackageDescription: 3-Pin Small Outline Transistor, Body 2.92 x 1.3 mm, Pitch 0.95 mm; ComponentLink1Description: Manufacturer URL; DatasheetVersion: Rev. 12
Q2 = CMP-18400-000025-1: OPTOISO 5KV LINEAR PHVOLT 8DIPGW; Manufacturer: Broadcom; Min Current Transfer Ratio: 0.36%; Forward Voltage: 1.6V; Standoff Height: 0.5mm; Isolation Voltage: 5000Vrms; Max Junction Temp: +125°C; Max Current Transfer Ratio: 0.72%; Power Dissipation: 60mW; Reverse Voltage: 2.5V; Forward Current: 10mA; Automotive: No; Temperature Range High: +85°C; ComponentLink2URL: https://docs.broadcom.com/docs/AV02-0886EN; Temperature Range Low: -40°C; Category: Trans; ComponentLink2Description: Datasheet; RoHS: TRUE; Device Class L3: unset; Device Class L1: Optoelectronics; Ambient Temperature Range High: +100°C; Octopart: https://octopart.com/hcnr201-500e-broadcom-71127631; Ambient Temperature Range Low: -55°C; Device Class L2: Optocouplers; Package: HCNR201-500E; Temperature: -40°C to +85°C; Manufacturer Part Number: HCNR201-500E; Height: 5mm; Lead Free: Yes; Mouser Description: High Linearity Optocouplers 1 Ch 60mW 25mA; Ipc Land Pattern Name: DIP1100W48P254L1130H510Q8; Digikey Description: OPTOISO 5KV LINEAR PHVOLT 8DIPGW
R1 R3 R12 R22 R23 R27 R29 R30 R32 R33 R35 R36 R39 R150 = CMP-2001-04376-1: Manufacturer: Panasonic; Part Number: ERJ-6ENF1002V
R2 R15 R17 R28 R31 R34 R37 R40 = CMP-2001-00045-1: Part Number: ERJ6ENF2202V; Manufacturer: Panasonic
R4 = CMP-2001-00550-1: Part Number: ERJ6ENF4701V; Manufacturer: Panasonic
R5 = CMP-2001-00567-1: Manufacturer: Panasonic; Part Number: ERJ6ENF6801V
R6 = CMP-2001-00090-1: Manufacturer: Panasonic; Part Number: ERJ6ENF2701V
R7 = CMP-1665-00004-4: Chip Resistor, 470 Ohm, +/- 1%, 0.125 W, -55 to 155 degC, 0805 (2012 Metric), RoHS, Tape and Reel; Manufacturer: Panasonic; Voltage Rating: 150 V; ComponentLink1URL: http://www.panasonic.com/; ComponentLink2Description: Datasheet; RoHSCompliant: true; PackageDescription: 2-Pin Surface Mount Device, Body 2 x 1.25 mm; PackageReference: 0805; REACH SVHC: Yes; Max Operating Temperature: 155 degC; Mount: Surface Mount; Min Operating Temperature: -55 degC; DatasheetVersion: 04/2015; Mounting Technology: Surface Mount; Height: 0.6 mm; Package Quantity: 1; ComponentLink2URL: http://industrial.panasonic.com/cdbs/www-data/pdf/RDA0000/AOA0000C86.pdf; Length: 2 mm; ComponentLink1Description: Manufacturer URL; Pins: 2; Packaging: Cut Tape
R8 = CMP-1018-00387-1: 82R 1W 1% 2512 (6432 Metric)  SMD; Case-EIA: 2512; Case-Metric: 6432; Value: 82.00 Ohm; Technology: SMT; Tolerance: 1 %; Power: 1 W
R9-R11 = CMP-2001-04377-1: Part Number: ERJ-6ENF1003V; Manufacturer: Panasonic
R13 R24 R26 = CMP-2001-00551-1: Manufacturer: Panasonic; Part Number: ERJ6ENF4702V
R14 = CMP-2001-04374-1: Manufacturer: Panasonic; Part Number: ERJ-6ENF1000V
R16 = CMP-2000-05590-1: 4 mm Square Trimpot(R) Trimming Potentiometer, 5 KOhm, +/- 20%, 0.25 W, -55 to 125 degC, 3-Pin SMD, RoHS, Tape and Reel; Manufacturer: Bourns; Power: 250; Angle of rotation: 240°; Resistance: 5; Curve: linear; Package Description: 3-Pin Surface Mount Device, Body 4.5 x 4.5 mm, Pitch 1.15 mm; Mounting Technology: SurfaceMount; Package Reference: 3314J-1; Package: J-lead; Manufacturer URL: http://www.bourns.com/; Datasheet Version: 05/2016; Tolerance: ±20%; Temperature range: -55...+125°C; Datasheet URL: http://www.bourns.com/docs/Product-Datasheets/3314.pdf
R18 R25 R38 R41 R42 = CMP-1665-00008-4: Chip Resistor, 1 KOhm, +/- 1%, 0.125 W, -55 to 155 degC, 0805 (2012 Metric), RoHS, Tape and Reel; Manufacturer: Panasonic; Voltage Rating: 150 V; ComponentLink1URL: http://www.panasonic.com/; ComponentLink2Description: Datasheet; REACH SVHC: Yes; ComponentLink1Description: Manufacturer URL; Length: 2 mm; Height: 0.6 mm; Package Quantity: 1; PackageDescription: 2-Pin Surface Mount Device, Body 2 x 1.25 mm; Packaging: Cut Tape; PackageReference: 0805; Max Operating Temperature: 155 degC; Mounting Technology: Surface Mount; ComponentLink2URL: http://industrial.panasonic.com/cdbs/www-data/pdf/RDA0000/AOA0000C86.pdf; DatasheetVersion: 04/2015; Min Operating Temperature: -55 degC; RoHSCompliant: true; Mount: Surface Mount
R19 = CMP-2001-00026-1: Manufacturer: Panasonic; Part Number: ERJ-6ENF2001V
R20 = CMP-2001-04416-1: Part Number: ERJ-6ENF1302V; Manufacturer: Panasonic
R21 = CMP-2001-00533-1: Manufacturer: Panasonic; Part Number: ERJ6ENF3301V
U1 = CMP-0240-00045-1: 2.5A, Switch step-down switching regulator, 1.235 to 35V, 8-Pin HSOP; DatasheetVersion: Jan-2008; PackageReference: HSO-8; ComponentLink1URL: http://www.st.com; PackageDescription: 8-Pin Small Outline Integrated Circuit 1.27 mm Pitch; ComponentLink2Description: Datasheet; ComponentLink1Description: Manufacturer URL; ComponentLink2URL: http://www.st.com/internet/com/TECHNICAL_RESOURCES/TECHNICAL_LITERATURE/DATASHEET/CD00002851.pdf; PackageVersion: 2007
U2 = CMP-0062-01638-4: 800mA Low-Dropout Linear Regulator, 4-pin SOT-223, Pb-Free; Manufacturer: Texas Instruments; CompType: LDO IC; PackageTopMarking: XYTT*N05A; High-Reliability: Y; PowerWise: N; ComponentLink1URL: http://www.ti.com/general/docs/lit/getliterature.tsp?genericPartNumber=LM1117-N&fileType=pdf; PinCount: 4; PackageDescription: Molded SOT-223, 6.50 x 3.56 x 1.6mm Body, 4 Lead, 2.3mm Pitch; Code_IPC: SOT223-4; PartNumber: LM1117MP-3.3/NOPB; Code_JEDEC: TO-261-AA; RoHS: Y; PackageReference: DCY0004A; ComponentLink1Description: Datasheet URL
U3 = CMP-2000-06569-1: Lowest Component Count, Energy-Efficient Off-Line Switcher IC, 85 to 265 V, 220 uA, -40 to 150 degC, 7-Pin SMD, RoHS, Tube; Manufacturer: Power Integrations; Output type: Adjustable; Function: Regulator; Topology: Flyback; Input voltage: 85...265VAC; Mounting Technology: SurfaceMount; Datasheet Version: Rev. J, 06/2013; Datasheet URL: http://www.mouser.com/ds/2/328/lnk302_304-306-179954.pdf; Package Reference: SMD-8B-7; Manufacturer URL: https://www.power.com/; Package: SMD-8B(7-PIN); Package Description: 7-Pin Surface Mount Device, Body 9.575 x 6.35 mm
U7 = CMP-1685-00009-1: Dual Operational Amplifier, 3 to 32 V, 0 to 70 degC, 8-Pin SOIC (D), Green (RoHS & no Sb/Br), Tape and Reel; DatasheetVersion: SLOS068T, 04/2015; ComponentLink1URL: http://www.ti.com/; ComponentLink2URL: http://www.ti.com/lit/ds/symlink/lm358.pdf; ComponentLink3Description: Package Specification; Code_JEDEC: MS-012; PackageDescription: 8-Pin Small Outline Integrated Circuit, Body 4.9 x 3.9 mm, Pitch 1.27 mm; ComponentLink2Description: Datasheet; PackageVersion: 4040047-3/M, 06/2011; ComponentLink1Description: Manufacturer URL; ComponentLink3URL: http://www.ti.com/lit/ml/msoi002j/msoi002j.pdf; PackageReference: D0008A
U8 = CMP-0187-00365-2: 1 MHz, Low-Power Operational Amplifier, 8-Pin SOIC, Industrial Temperature; Code_JEDEC: MS-012; ComponentLink3Description: Package Specification; ComponentLink3URL: http://www.microchip.com/stellent/groups/techpub_sg/documents/packagingspec/en012702.pdf; ComponentLink2Description: Datasheet; ComponentLink2URL: http://ww1.microchip.com/downloads/en/DeviceDoc/21733j.pdf; PackageReference: SOIC-SN8; DatasheetVersion: revJ, Nov-2009; RevisionNote: URLs added.; Code_IPC: SOIC127P600-8; PackageVersion: revBB, Aug-2009; ComponentLink1Description: Manufacturer URL; ComponentLink1URL: http://www.microchip.com/; PackageDescription: 8-Lead Plastic Small Outline (SN) - Narrow, 3.90mm Body [SOIC]